# Altium project Frequency_Voltage_Board.PrjPcb
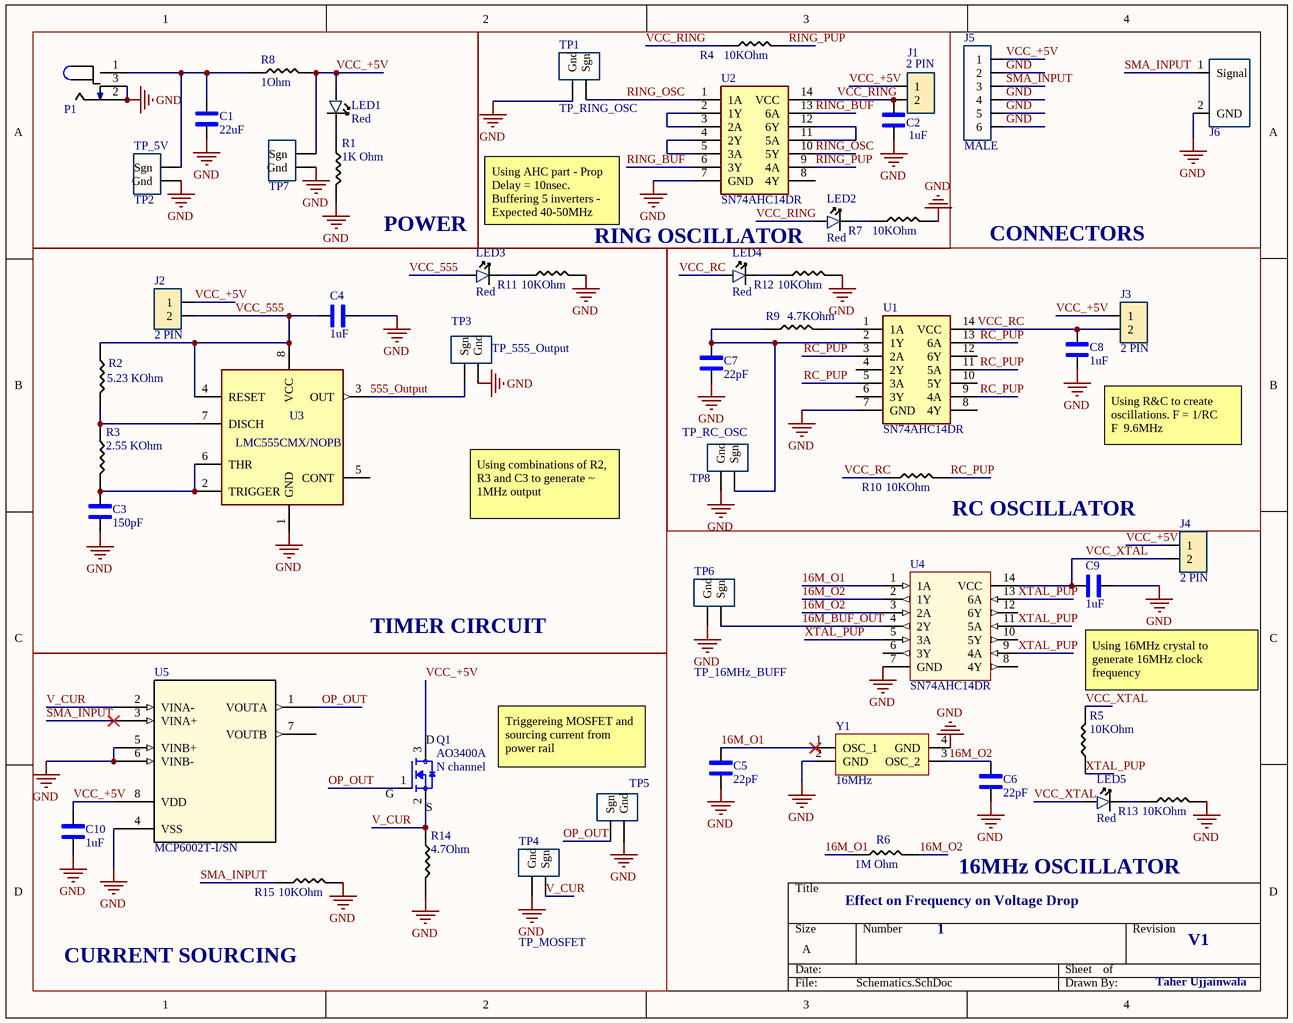
[diagram p0: Schematics.SchDoc]
1 sheet, 52 parts. Net scope: global (net labels, ports and power ports of the same name join across sheets).
Board file: Layout.PcbDoc

## Sheet Schematics.SchDoc
size A; SheetNumber: 1; SheetTotal: 1

### Parts
C1  22uF  [0805_Passive_Capaciitor]
C2  1uF  [0402_Passive_Capacitor]
C3  150pF  [0402_Passive_Capacitor]
C4  1uF  [0402_Passive_Capacitor]
C5  22pF  [0402_Passive_Capacitor]
C6  22pF  [0402_Passive_Capacitor]
C7  22pF  [0402_Passive_Capacitor]
C8  1uF  [0402_Passive_Capacitor]
C9  1uF  [0402_Passive_Capacitor]
C10  1uF  [0402_Passive_Capacitor]
J1  2 PIN  [2_PIN_100MIL]
J2  2 PIN  [2_PIN_100MIL]
J3  2 PIN  [2_PIN_100MIL]
J4  2 PIN  [2_PIN_100MIL]
J5  MALE  [6_PIN_100MIL-Male]
J6  SMA Edge Launched  [SMA_2_LAYER]  (value not drawn)
LED1  value Red  [LED_0603]  (hidden comment: KT-0603R)
LED2  value Red  [LED_0603]  (hidden comment: KT-0603R)
LED3  value Red  [LED_0603]  (hidden comment: KT-0603R)
LED4  value Red  [LED_0603]  (hidden comment: KT-0603R)
LED5  value Red  [LED_0603]  (hidden comment: KT-0603R)
P1  Power Jack  [Power_Jack]  (value not drawn)
Q1  AO3400A  value N channel  [N-MOSFET]
R1  value 1K Ohm  [0805_Passive_Resistor]  (hidden comment: 1k)
R2  value 5.23 KOhm  [0402_Passive_Resistor]  (hidden comment: 1 Ohm)
R3  value 2.55 KOhm  [0402_Passive_Resistor]  (hidden comment: 2.55 KOhms)
R4  value 10KOhm  [0402_Passive_Resistor]  (hidden comment: 10k)
R5  value 10KOhm  [0402_Passive_Resistor]  (hidden comment: 10k)
R6  value 1M Ohm  [0402_Passive_Resistor]  (hidden comment: 1M)
R7  value 10KOhm  [0402_Passive_Resistor]  (hidden comment: 10k)
R8  value 1Ohm  [1206_Passive_Resitor]  (hidden comment: 1 Ohm)
R9  4.7KOhm  [1206_Passive_Resitor]
R10  value 10KOhm  [0402_Passive_Resistor]  (hidden comment: 10k)
R11  value 10KOhm  [0402_Passive_Resistor]  (hidden comment: 10k)
R12  value 10KOhm  [0402_Passive_Resistor]  (hidden comment: 10k)
R13  value 10KOhm  [0402_Passive_Resistor]  (hidden comment: 10k)
R14  4.7Ohm  [1206_Passive_Resitor]
R15  value 10KOhm  [0402_Passive_Resistor]  (hidden comment: 10k)
TP1  TP_RING_OSC  [TP10x_Probe]
TP2  TP_5V  [TP10x_Probe]
TP3  TP_555_Output  [TP10x_Probe]
TP4  TP_MOSFET  [TP10x_Probe]
TP5  10x Probe TP  [TP10x_Probe]  (value not drawn)
TP6  TP_16MHz_BUFF  [TP10x_Probe]
TP7  10x Probe TP  [TP10x_Probe]  (value not drawn)
TP8  TP_RC_OSC  [TP10x_Probe]
U1  SN74AHC14DR  [HEX_74AC14]
U2  SN74AHC14DR  [HEX_74AC14]
U3  LMC555CMX/NOPB  [TS555IDTTR]
U4  SN74AHC14DR  [SOIC127P600X175-14N]
U5  MCP6002T-I/SN  [SOIC127P600X175-8N]
Y1  value 16MHz  [Crystal resonator]  (hidden comment: X322516MLB4SI)

### Blocks framed on the sheet
POWER: C1 LED1 P1 R1 R8 TP2 TP7
RING OSCILLATOR: C2 J1 LED2 R4 R7 TP1 U2
TIMER CIRCUIT: C3 C4 J2 LED3 R2 R3 R11 TP3 U3

### Nets
GND: C1.1 C2.1 C3.1 C4.2 C5.1 C6.1 C7.1 C8.1 C9.2 C10.1 J5.2 J5.4 J5.5 J5.6 J6.2(GND) P1.2 P1.3 R1.2 R7.2 R11.2 R12.2 R13.2 R14.2 R15.2 TP1.2(Gnd) TP2.2(Gnd) TP3.2(Gnd) TP4.2(Gnd) TP5.2(Gnd) TP6.2(Gnd) TP7.2(Gnd) TP8.2(Gnd) U1.7(GND) U2.7(GND) U3.1(GND) U4.7(GND) U5.4(VSS) U5.5(VINB+) U5.6(VINB-) Y1.2(GND) Y1.4(GND)
16M_BUF_OUT: TP6.1(Sgn) U4.4(2Y)
16M_O1: C5.2 R6.1 U4.1(1A) Y1.1(OSC_1)
16M_O2: C6.2 R6.2 U4.2(1Y) U4.3(2A) Y1.3(OSC_2)
555_Output: TP3.1(Sgn) U3.3(OUT)
OP_OUT: Q1.1(G) TP5.1(Sgn) U5.1(VOUTA)
RC_PUP: R10.2 U1.3(2A) U1.5(3A) U1.9(4A) U1.11(5A) U1.13(6A)
RING_BUF: U2.6(3Y) U2.13(6A)
RING_OSC: TP1.1(Sgn) U2.1(1A) U2.10(5Y)
RING_PUP: R4.2 U2.9(4A)
SMA_INPUT: J5.3 J6.1(Signal) R15.1 U5.3(VINA+)
V_CUR: Q1.2(S) R14.1 TP4.1(Sgn) U5.2(VINA-)
VCC_555: C4.1 J2.2 LED3.1 R2.1 U3.4(RESET) U3.8(VCC)
VCC_+5V: C10.2 J1.1 J2.1 J3.1 J4.1 J5.1 LED1.1 Q1.3(D) R8.2 TP7.1(Sgn) U5.8(VDD)
VCC_RC: C8.2 J3.2 LED4.1 R10.1 U1.14(VCC)
VCC_RING: C2.2 J1.2 LED2.1 R4.1 U2.14(VCC)
VCC_XTAL: C9.1 J4.2 LED5.1 R5.2 U4.14(VCC)
XTAL_PUP: R5.1 U4.5(3A) U4.9(4A) U4.11(5A) U4.13(6A)
NetC1_2: C1.2 P1.1 R8.1 TP2.1(Sgn)
NetC3_2: C3.2 R3.2 U3.2(TRIGGER) U3.6(THR)
NetC7_2: C7.2 R9.1 TP8.1(Sgn) U1.2(1Y)
NetLED1_2: LED1.2 R1.1
NetLED2_2: LED2.2 R7.1
NetLED3_2: LED3.2 R11.1
NetLED4_2: LED4.2 R12.1
NetLED5_2: LED5.2 R13.1
NetR2_2: R2.2 R3.1 U3.7(DISCH)
NetR9_2: R9.2 U1.1(1A)
NetU2_2: U2.2(1Y) U2.3(2A)
NetU2_4: U2.4(2Y) U2.5(3A)
NetU2_11: U2.11(5A) U2.12(6Y)

Not connected (* = marked no-connect by the designer): U1 4(2Y) 6(3Y) 8(4Y) 10(5Y) 12(6Y); U2 8(4Y); U3 5(CONT); U4 6(3Y) 8(4Y) 10(5Y) 12(6Y); U5 7(VOUTB)

### Notes on the sheet
- Using AHC part - Prop Delay = 10nsec.
  Buffering 5 inverters - Expected 40-50MHz
- CONNECTORS
- Using R&C to create oscillations. F = 1/RC
  F  9.6MHz
- Using combinations of R2, R3 and C3 to generate ~ 1MHz output
- (near R10) RC OSCILLATOR
- Using 16MHz crystal to generate 16MHz clock frequency
- Triggereing MOSFET and sourcing current from power rail
- (near R6) Effect on Frequency on Voltage Drop
- 16MHz OSCILLATOR
- CURRENT SOURCING
- 1
- V1
- Taher Ujjainwala

### Library data of the parts
C1 = C_22uF_0805: MULTILAYER CERAMIC CAPACITORS MLCC - SMD/SMT 22UF 25V 0805 ROHS; MFR Part #: CL21A226MAQNNNE; Type: Basic; Datasheet: https://datasheet.lcsc.com/szlcsc/Samsung-Electro-Mechanics-CL21A226MAQNNNE_C45783.pdf; LCSC Part#: C45783; Value: 22uF
C2 C4 C8-C10 = C_1uF_0402: MULTILAYER CERAMIC CAPACITORS MLCC - SMD/SMT 1UF 25V 0402 ROHS; MFR Part #: CL05A105KA5NQNC; Type: Basic; Datasheet: https://datasheet.lcsc.com/szlcsc/Samsung-Electro-Mechanics-CL05A105KA5NQNC_C52923.pdf; LCSC Part#: C52923; Value: 1uF
C3 = C_150pF_0402: MULTILAYER CERAMIC CAPACITORS MLCC - SMD/SMT 1UF 25V 0402 ROHS; MFR Part #: 0402B151K500NT; Type: Basic; Datasheet: https://datasheet.lcsc.com/lcsc/1810302110_FH--Guangdong-Fenghua-Advanced-Tech-0402B151K500NT_C1527.pdf; LCSC Part#: C1527; Value: 150pF
C5-C7 = C_22pF_0402: MULTILAYER CERAMIC CAPACITORS MLCC - SMD/SMT 22PF 50V 0402 ROHS; MFR Part #: 0402CG220J500NT; Type: Basic; Datasheet: https://datasheet.lcsc.com/szlcsc/Guangdong-Fenghua-Advanced-Tech-0402CG220J500NT_C1555.pdf; LCSC Part#: C1555; Value: 22pF
J1-J4 = JM_2_PIN_MALE: 2.54mm Straight 2 1 Header，Breakaway Through Hole,P=2.54mm Pin Header & Female Header ROHS; MFR Part #: B-2100S02P-A110; Type: Extended; Datasheet: https://datasheet.lcsc.com/lcsc/1811151421_Ckmtw-Shenzhen-Cankemeng-B-2100S02P-A110_C124375.pdf; LCSC Part#: C124375; Value: 2 PIN
J5 = JM_6_PIN_MALE: Male header- 6 pin 1 row- through Hole; LCSC Part#: C37208; Datasheet: https://datasheet.lcsc.com/szlcsc/1810312320_BOOMELE-Boom-Precision-Elec-C37208_C37208.pdf; Type: Extended; Value: MALE
J6 = J_SMA_2_Layer: 2 Layer SMA Connector Without Cutout Under Signal
LED1-LED5 = LED_RED_0603: LIGHT EMITTING DIODES (LED) RED 520~625NM 90~100MCD@20MA TOP VIEW 0603 ROHS; Type: Basic; Datasheet: https://datasheet.lcsc.com/szlcsc/Everlight-Elec-19-217-BHC-ZL1M2RY-3T_C72041.pdf; MFR Part #: KT-0603R; LCSC Part#: C2286
P1 = P_Power Jack: Power Barrel Connector Jack 2.10mm ID (0.083"), 5.50mm OD (0.217") Through Hole, Right Angle; Value: CONN PWR JACK 2X5.5MM SOLDER; Digikey Link: https://www.digikey.com/product-detail/en/PJ-102A/CP-102A-ND/275425/?itemSeq=304982367; Digikey Part: CP-102A-ND; LCSC Part#: C136744; Type: Extended
Q1 = Q_Nch_MOSFET: MOSFET N Trench 30V 5.7A 1.5V @ 250uA 26.5 m? @ 5.7A,10V SOT-23-3L RoHS; Type: Basic; LCSC Part#: C20917; Datasheet: https://datasheet.lcsc.com/szlcsc/Alpha-Omega-Semicon-AOS-AO3400A_C20917.pdf; MFR Part #: AO3400A
R1 = R_1K_0805: CHIP RESISTOR - SURFACE MOUNT 1KOHMS ±1% 1/8W 0805 ROHS; MFR Part #: 0805W8F1001T5E; LCSC Part#: C17513; Type: Basic
R2 = R_5.23KOhm_0402: 62.5mW Thick Film Resistors 50V ±100ppm/℃ ±1% -55℃~+155℃ 5.23kΩ 0402 Chip Resistor - Surface Mount ROHS; MFR Part #: 0402WGF5231TCE; Datasheet: https://datasheet.lcsc.com/lcsc/2206010045_UNI-ROYAL-Uniroyal-Elec-0402WGF5231TCE_C25907.pdf; LCSC Part#: C25907; Type: Basic
R3 = R_2.55 KOhm_0402: 62.5mW Thick Film Resistors 50V ±100ppm/℃ ±1% -55℃~+155℃ 2.55kΩ 0402 Chip Resistor - Surface Mount ROHS; MFR Part #: RC0402FR-072K55L; Datasheet: https://datasheet.lcsc.com/lcsc/2206010045_UNI-ROYAL-Uniroyal-Elec-0402WGF5231TCE_C25907.pdf; LCSC Part#: C185431; Type: Basic
R4 R5 R7 R10-R13 R15 = R_10KOhm_0402: CHIP RESISTOR - SURFACE MOUNT 10KOHMS ±1% 1/16W 0402 ROHS; MFR Part #: 0402WGF1002TCE; Datasheet: https://datasheet.lcsc.com/szlcsc/Uniroyal-Elec-0402WGF1002TCE_C25744.pdf; LCSC Part#: C25744; Type: Basic
R6 = R_1M_0402: CHIP RESISTOR - SURFACE MOUNT 1MOHMS ±1% 1/16W 0402 ROHS; MFR Part #: 0402WGF1004TCE; Datasheet: https://datasheet.lcsc.com/szlcsc/Uniroyal-Elec-0402WGF1004TCE_C26083.pdf; LCSC Part#: C26083; Type: Basic
R8 = R_1Ohm_1206: 1Ω ±5% 0.25W ±400ppm/℃ 1206 Chip Resistor - Surface Mount RoHS; MFR Part #: 1206W4J010JT5E; LCSC Part#: C1409; Datasheet: https://datasheet.lcsc.com/lcsc/1810301410_UNI-ROYAL-Uniroyal-Elec-1206W4J010JT5E_C1409.pdf; Type: Extended
R9 = R_4.7k_1206: 4.7kΩ ±1% 0.25W ±100ppm/℃ 1206 Chip Resistor - Surface Mount RoHS; MFR Part #: 1206W4F4701T5E; LCSC Part#: C17936; Datasheet: https://datasheet.lcsc.com/lcsc/1810301414_UNI-ROYAL-Uniroyal-Elec-1206W4F4701T5E_C17936.pdf; Type: Basic; Value: 4.7KOhm
R14 = R_4.7Ohm_1206: 4.7Ω ±5% 0.25W ±400ppm/℃ 1206 Chip Resistor - Surface Mount RoHS; MFR Part #: 1206W4F470KT5E; LCSC Part#: C17937; Datasheet: https://datasheet.lcsc.com/lcsc/2206010145_UNI-ROYAL-Uniroyal-Elec-1206W4F470KT5E_C17937.pdf; Type: Extended; Value: 4.7Ohm
TP1-TP8 = TP_10x_Probe: Test Point 300 mil centers
U1 U2 = U_74_AHC_Hex: Inverter IC 6 Channel Schmitt Trigger 14-SOIC; Datasheet: https://datasheet.lcsc.com/szlcsc/ON-Semicon-ON-74AC14SCX_C5482.pdf; MFR Part #: SN74AHC14DR; LCSC Part#: C6942; Type: Extended
U3 = U_555_Fast: 555 Type, Timer/Oscillator _Single_ IC 3MHz 8-SO; Package: SOIC-8; MFR Part #: LMC555CMX/NOPB; DigiKey-Purchase-URL: https://www.digikey.com/product-detail/en/texas-instruments/LMC555CMX-NOPB/LMC555CMX-NOPBCT-ND/1010550; LCSC Part#: C90760; Type: Extended
U4 = SN74AHC14DR: 6-ch, 2-V to 5.5-V inverters with Schmitt-Trigger inputs; MF: Texas Instruments; Package: SOIC-14 Texas Instruments; Check_prices: https://www.snapeda.com/parts/SN74AHC14DR/Texas+Instruments/view-part/?ref=eda; Purchase-URL: https://pricing.snapeda.com/search/part/SN74AHC14DR/?ref=eda; Price: None; MP: SN74AHC14DR; Value: *; Availability: In Stock; SnapEDA_Link: https://www.snapeda.com/parts/SN74AHC14DR/Texas+Instruments/view-part/?ref=snap; Parameter 1: *
U5 = U_MCP6002T-I/SN: 0.6 V/us 2 1MHz 1.8V ~ 6V 100μA General Purpose SOIC-8_150mil  Operational Amplifier ROHS; Mfr: Microchip; MFR Part #: MCP6002T-I/SN; DataSheet: https://ww1.microchip.com/downloads/en/DeviceDoc/MCP6001-1R-1U-2-4-1-MHz-Low-Power-Op-Amp-DS20001733L.pdf; LCSC Part#: C7377; Type: Basic
Y1 = X_16Mhz_Res: ±10ppm 16000000Hz -40℃~85℃ 贴片无源晶振 60Ω 9pF SMD3225-4P Crystals ROHS; LCSC Part#: C13738; MFR Part #: X322516MLB4SI; Type: Basic